# EAGLE design Park-A (EAGLE 7.5.0)
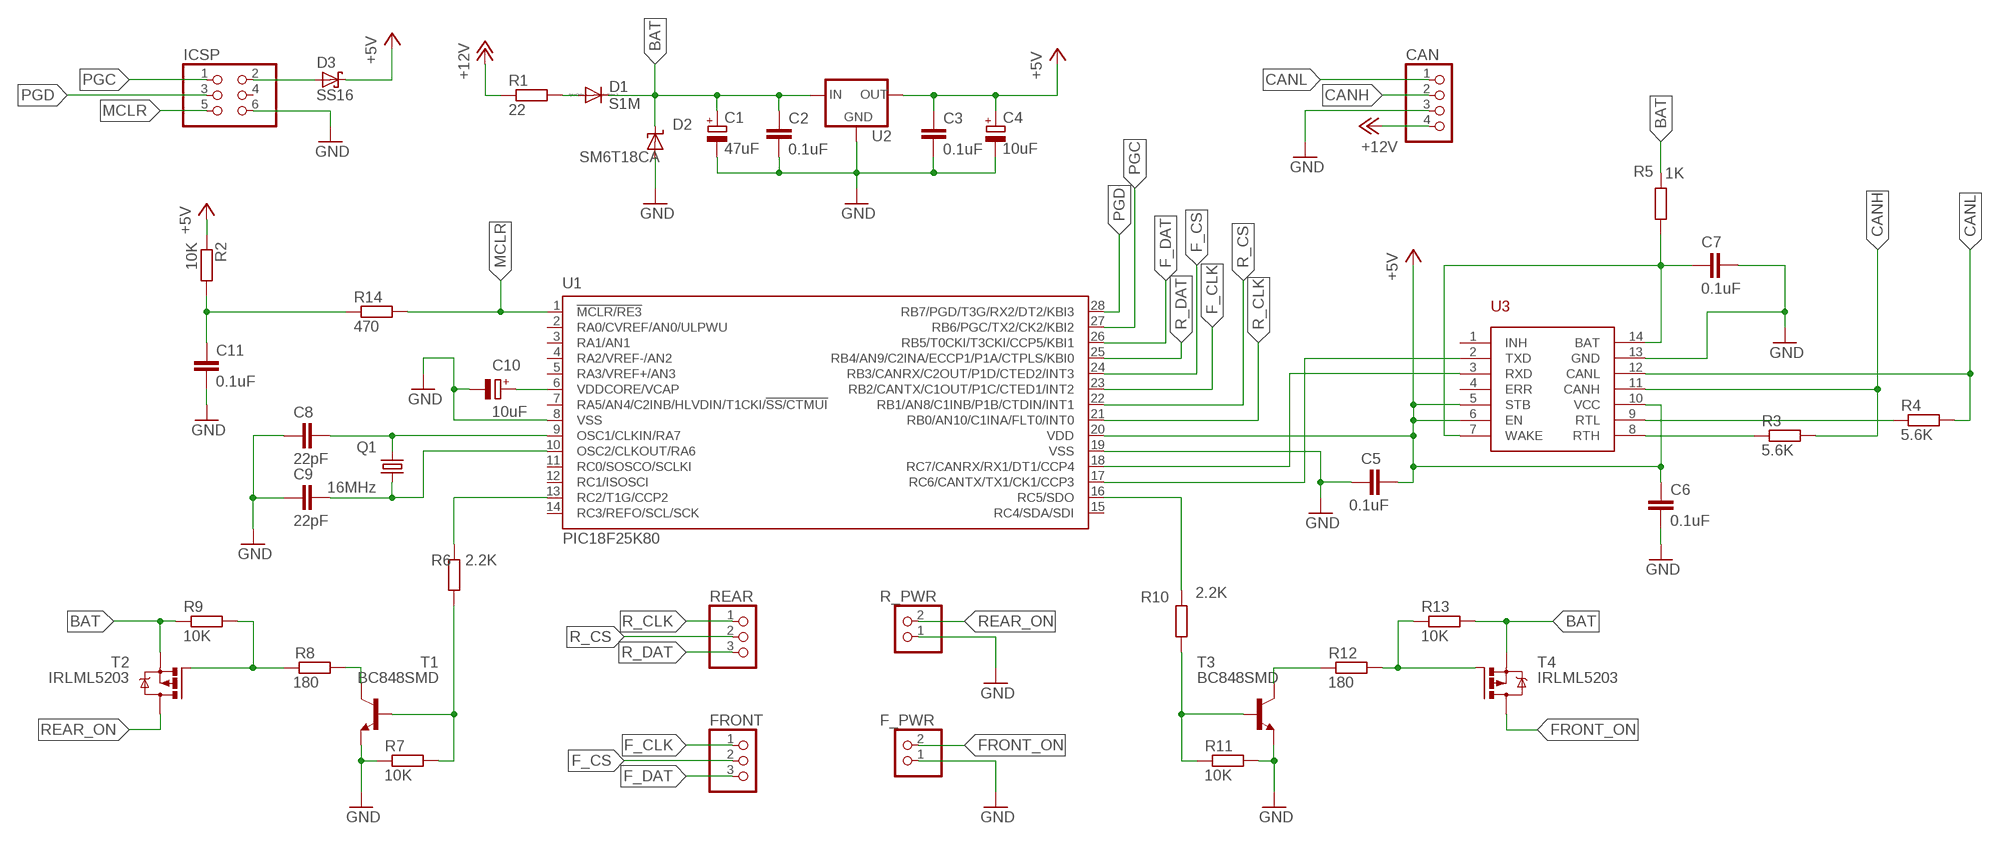
[diagram p0: schematic, sheet 1]

## Parts
C1  47uF  CPOL-EU140CLH-0810  [140CLH-0810]
C2  0.1uF  C-EUC0805  [C0805]
C3  0.1uF  C-EUC0805  [C0805]
C4  10uF  CPOL-EU153CLV-0605  [153CLV-0605]
C5  0.1uF  C-EUC0805  [C0805]
C6  0.1uF  C-EUC0805  [C0805]
C7  0.1uF  C-EUC0805  [C0805]
C8  22pF  C-EUC0805  [C0805]
C9  22pF  C-EUC0805  [C0805]
C10  10uF  CPOL-EUSMCA  [SMC_A]
C11  0.1uF  C-EUC0805  [C0805]
CAN  PINHD-1X4  [1X04]
D1  S1M  [SMA]
D2  SM6T18CA  SUPPRESSOR-SMBJ  [SMBJ]
D3  SS16  [DO214AC]
F_PWR  PINHD-1X2  [1X02]
FRONT  PINHD-1X3  [1X03]
ICSP  PINHD-2X3  [2X03]
Q1  16MHz  CRYSTALHC49S  [HC49/S]
R1  22  R-EU_M1206  [M1206]
R2  10K  R-EU_R0805  [R0805]
R3  5.6K  R-EU_R0805  [R0805]
R4  5.6K  R-EU_R0805  [R0805]
R5  1K  R-EU_R0805  [R0805]
R6  2.2K  R-EU_R0805  [R0805]
R7  10K  R-EU_R0805  [R0805]
R8  180  R-EU_R0805  [R0805]
R9  10K  R-EU_R0805  [R0805]
R10  2.2K  R-EU_R0805  [R0805]
R11  10K  R-EU_R0805  [R0805]
R12  180  R-EU_R0805  [R0805]
R13  10K  R-EU_R0805  [R0805]
R14  470  R-EU_R0805  [R0805]
R_PWR  PINHD-1X2  [1X02]
REAR  PINHD-1X3  [1X03]
T1  BC848SMD  [SOT23]
T2  IRLML5203  [SOT23]
T3  BC848SMD  [SOT23]
T4  IRLML5203  [SOT23]
U1  PIC18F25K80  [SO28W]
U2  78M05  [DPACK]
U3  TJA1055T  [SO-14W]

## Nets
+5V: C3.1 C4.+ C5.1 C6.1 D3.C R2.1 U1.20(VDD) U2.3(OUT) U3.5(STB) U3.6(EN) U3.10(VCC)
+12V: CAN.4 R1.1
BAT: C1.+ C2.1 D1.C D2.C R5.2 R9.1 R13.2 T2.2(S) T4.2(S) U2.1(IN)
CANH: CAN.2 R3.2 U3.11(CANH)
CANL: CAN.1 R4.2 U3.12(CANL)
F_CLK: FRONT.1 U1.23(RB2/CANTX/C1OUT/P1C/CTED1/INT2)
F_CS: FRONT.2 U1.24(RB3/CANRX/C2OUT/P1D/CTED2/INT3)
F_DAT: FRONT.3 U1.26(RB5/T0CKI/T3CKI/CCP5/KBI1)
FRONT_ON: F_PWR.2 T4.3(D)
GND: C1.- C2.2 C3.2 C4.- C5.2 C6.2 C7.2 C8.1 C9.1 C10.- C11.2 CAN.3 D2.A F_PWR.1 ICSP.6 R7.1 R11.2 R_PWR.1 T1.2(E) T3.2(E) U1.8(VSS) U1.19(VSS) U2.4(GND) U3.13(GND)
MCLR: ICSP.5 R14.2 U1.1(!MCLR/RE3)
N$1: D1.A R1.2
N$2: U1.17(RC6/CANTX/TX1/CK1/CCP3) U3.2(TXD)
N$3: U1.18(RC7/CANRX/RX1/DT1/CCP4) U3.3(RXD)
N$4: C11.1 R2.2 R14.1
N$5: C8.2 Q1.1 U1.9(OSC1/CLKIN/RA7)
N$6: C7.1 R5.1 U3.7(WAKE) U3.14(BAT)
N$7: C9.2 Q1.2 U1.10(OSC2/CLKOUT/RA6)
N$8: C10.+ U1.6(VDDCORE/VCAP)
N$9: R6.2 U1.13(RC2/T1G/CCP2)
N$10: R6.1 R7.2 T1.1(B)
N$11: R3.1 U3.8(RTH)
N$12: R4.1 U3.9(RTL)
N$13: R8.1 T1.3(C)
N$14: R8.2 R9.2 T2.1(G)
N$15: R10.2 U1.16(RC5/SDO)
N$16: R10.1 R11.1 T3.1(B)
N$17: R12.1 T3.3(C)
N$18: R12.2 R13.1 T4.1(G)
N$20: D3.A ICSP.2
PGC: ICSP.1 U1.27(RB6/PGC/TX2/CK2/KBI2)
PGD: ICSP.3 U1.28(RB7/PGD/T3G/RX2/DT2/KBI3)
R_CLK: REAR.1 U1.21(RB0/AN10/C1INA/FLT0/INT0)
R_CS: REAR.2 U1.22(RB1/AN8/C1INB/P1B/CTDIN/INT1)
R_DAT: REAR.3 U1.25(RB4/AN9/C2INA/ECCP1/P1A/CTPLS/KBI0)
REAR_ON: R_PWR.2 T2.3(D)
Unconnected: ICSP.4 U1.2(RA0/CVREF/AN0/ULPWU) U1.3(RA1/AN1) U1.4(RA2/VREF-/AN2) U1.5(RA3/VREF+/AN3) U1.7(RA5/AN4/C2INB/HLVDIN/T1CKI/!SS/CTMUI) U1.11(RC0/SOSCO/SCLKI) U1.12(RC1/ISOSCI) U1.14(RC3/REFO/SCL/SCK) U1.15(RC4/SDA/SDI) U3.1(INH) U3.4(ERR)

## Library data of the parts
C1 C4 C10 = rcl:CPOL-EU: POLARIZED CAPACITOR, European symbol
C2 C3 C5-C9 C11 = rcl:C-EU: CAPACITOR, European symbol
CAN = Park-A:PINHD-1X4: PIN HEADER
D1 = diode:S1M
D2 = diode:SUPPRESSOR-: Suppressor diode
D3 = Park-A:SS16
F_PWR R_PWR = Park-A:PINHD-1X2: PIN HEADER
FRONT REAR = Park-A:PINHD-1X3: PIN HEADER
ICSP = Park-A:PINHD-2X3: PIN HEADER
Q1 = Park-A:CRYSTAL: CRYSTAL; OC_FARNELL: 1667008; OC_NEWARK: unknown
R1-R14 = rcl:R-EU_: RESISTOR, European symbol
T1 T3 = Park-A:BC848*: NPN Transistor
T2 T4 = Park-A:IRLML5203: HEXFET P-Channel Power MOSFET
U1 = Park-A:PIC18F25K80
U2 = Park-A:78M05
U3 = Park-A:TJA1055T

## Board
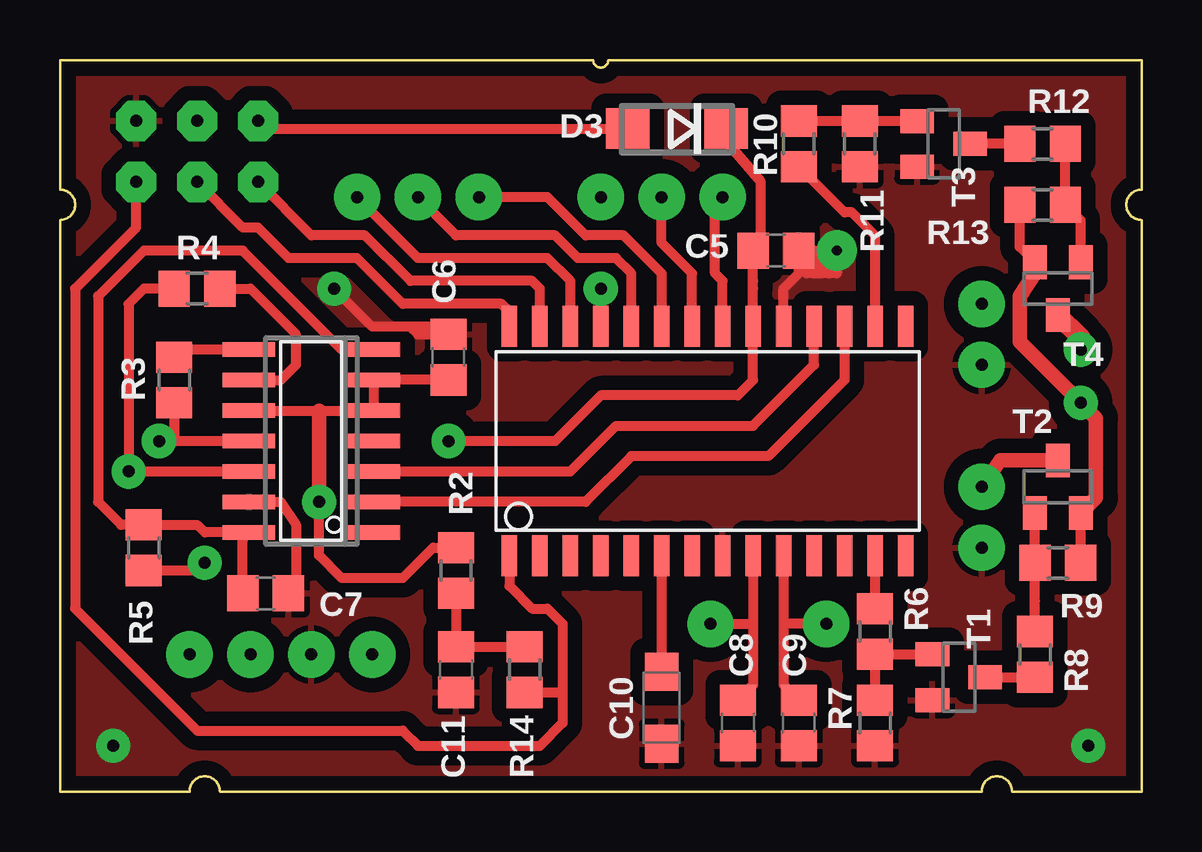
[diagram p1: board, top side]
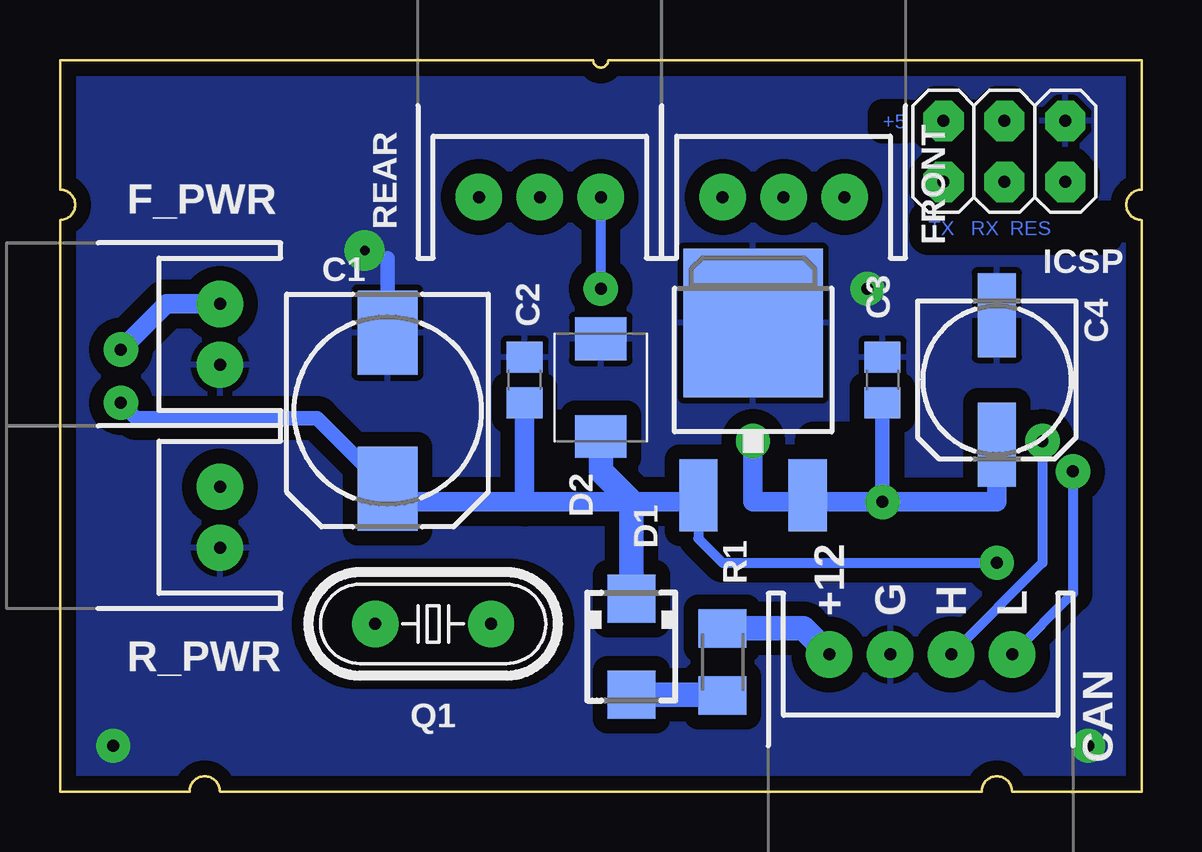
[diagram p2: board, bottom side, seen from below]

Size 45.09 x 30.48 mm. Coordinates in mm from the lower left corner, seen from the top.
Outline: 22.86,30.48 arc-180 22.23,30.48 0,30.48 0,25.08 arc-180 0,23.81 0,0 5.4,0 arc-180 6.67,0 38.42,0 arc-180 39.69,0 45.09,0 45.09,23.81 arc-180 45.09,25.08 45.09,30.48 22.86,30.48
Copper layers (1*16): Top 0.035mm / dielectric 1.5mm / Bottom 0.035mm
Design rules "ITEADstudio_DRC *": minimum track width 6mil, minimum drill 12mil, track to track 6mil, track to pad 6mil, pad to pad 6mil, via to via 6mil, smd to smd 0mil, copper to edge 10mil, drill to drill 10mil, minimum pad ring 10mil, minimum via ring 6mil, stop-mask expansion 2mil, vias tented up to drill 100mil, thermal gap 10mil
tRestrict: 8 lines
bRestrict: 9 lines

### Footprints (pad centres in the part's own frame; a part is rotated, then mirrored left to right if it is on the bottom)
140CLH-0810 = smd 3.5 x 2.5: + 3.25,0; - -3.25,0
C0805 = smd 1.3 x 1.5: 1 -0.95,0; 2 0.95,0
153CLV-0605 = smd 3.5 x 1.6: + 2.7,0; - -2.7,0
SMC_A = smd 1.6 x 1.4: + -1.5,0; - 1.5,0
1X04 = drill 0.5 pad 1.93: 1 -3.81,0; 2 -1.27,0; 3 1.27,0; 4 3.81,0
SMA = smd 2 x 2: A 2,0; C -2,0
SMBJ = smd 1.78 x 2.16: A 2.04,0; C -2.03,0
DO214AC = smd 1.8 x 1.7: A 2.05,0; C -2.05,0
1X02 = drill 0.5 pad 1.93: 1 -1.27,0; 2 1.27,0
1X03 = drill 0.5 pad 1.93: 1 -2.54,0; 2 0,0; 3 2.54,0
2X03 = drill 0.5 pad 1.676 octagon: 1 -2.54,-1.27; 2 -2.54,1.27; 3 0,-1.27; 4 0,1.27; 5 2.54,-1.27; 6 2.54,1.27
HC49/S = drill 0.5 pad 1.93: 1 -2.413,0; 2 2.413,0
M1206 = smd 1.6 x 2: 1 -1.4,0; 2 1.4,0
R0805 = smd 1.3 x 1.5: 1 -0.95,0; 2 0.95,0
SOT23 = smd 1 x 1.4: 1 -0.95,-1.1; 2 0.95,-1.1; 3 0,1.1
SO28W = smd 0.65 x 1.7: 1 -7.62,-4.78; 2 -6.35,-4.78; 3 -5.08,-4.78; 4 -3.81,-4.78; 5 -2.54,-4.78; 6 -1.27,-4.78; 7 0,-4.78; 8 1.27,-4.78; 9 2.54,-4.78; 10 3.81,-4.78; 11 5.08,-4.78; 12 6.35,-4.78; 13 7.62,-4.78; 14 8.89,-4.78; 15 8.89,4.78; 16 7.62,4.78; 17 6.35,4.78; 18 5.08,4.78; 19 3.81,4.78; 20 2.54,4.78; 21 1.27,4.78; 22 0,4.78; 23 -1.27,4.78; 24 -2.54,4.78; 25 -3.81,4.78; 26 -5.08,4.78; 27 -6.35,4.78; 28 -7.62,4.78
DPACK = smd 1.6 x 3: 1 -2.28,-4.8; 3 2.28,-4.8 | smd 5.8 x 6.2: 4 0,2.38
SO-14W = smd 0.6 x 2.2: 1 -3.81,-2.6; 2 -2.54,-2.6; 3 -1.27,-2.6; 4 0,-2.6; 5 1.27,-2.6; 6 2.54,-2.6; 7 3.81,-2.6; 8 3.81,2.6; 9 2.54,2.6; 10 1.27,2.6; 11 0,2.6; 12 -1.27,2.6; 13 -2.54,2.6; 14 -3.81,2.6

### Placement (x,y rotation side)
C1  31.43,15.88 270 bottom
C2  25.72,17.14 90 bottom
C3  10.8,17.14 90 bottom
C4  6.03,17.14 270 bottom
C5  29.84,22.54 0 top
C6  16.19,18.1 90 top
C7  8.57,8.25 0 top
C8  28.26,2.86 90 top
C9  30.8,2.86 90 top
C10  25.08,3.49 270 top
C11  16.51,5.08 270 top
CAN  9.21,5.71 180 bottom
D1  21.27,6.03 270 bottom
D2  22.54,16.83 90 bottom
D3  25.72,27.62 180 top
F_PWR  38.42,19.05 90 bottom
FRONT  14.92,24.76 0 bottom
ICSP  5.71,26.67 0 bottom
Q1  29.53,6.98 180 bottom
R1  17.46,5.4 270 bottom
R2  16.51,9.21 270 top
R3  4.76,17.14 270 top
R4  5.71,20.95 180 top
R5  3.49,10.16 270 top
R6  33.97,6.67 90 top
R7  33.97,2.86 90 top
R8  40.64,5.71 90 top
R9  41.59,9.52 180 top
R10  30.8,26.99 270 top
R11  33.34,26.99 270 top
R12  40.96,26.99 0 top
R13  40.96,24.45 180 top
R14  19.37,5.08 270 top
R_PWR  38.42,11.43 90 bottom
REAR  25.08,24.76 0 bottom
T1  37.47,4.76 270 top
T2  41.59,12.7 0 top
T3  36.83,26.99 270 top
T4  41.59,20.95 180 top
U1  26.35,14.6 0 top
U2  16.19,17.14 0 bottom
U3  10.48,14.6 90 top

### Tracks (layer width: path | path; a pad name or v marks a point on that pad's centre or on a via)
+5V  (via drill 0.5 pad 1.42)
  Top 0.406: v10.8,12.06 10.8,9.84 11.75,8.89 14.29,8.89 15.55,10.16 R2.1 | U3.10 10.8,15.88 U3.5 U3.6 C6.1 | v16.19,14.6 20.64,14.6 22.54,16.51 28.26,16.51 28.89,17.14 U1.20 28.89,20.95 28.9,21.27 C5.1 29.21,23.17 29.21,25.4 27.45,27.48 D3.C
  Top 0.61: 10.8,15.88 v10.8,12.06
  Bottom 0.61: C3.1 v10.8,12.06
  Bottom 0.813: C4.+ 6.03,12.06 v10.8,12.06 13.65,12.06 13.91,12.32 U2.3 14.19,12.06 16.19,12.06 v16.19,14.6
+12V
  Bottom 1.016: CAN.4 14.1,6.8 R1.1
BAT  (via drill 0.5 pad 1.42)
  Top 0.406: R5.2 5.72,9.21 v6.03,9.52 | R9.1 T2.2 | T4.2 40.01,22.69 R13.2
  Top 0.61: T4.2 40.64,21.59 40.01,20.64 40.01,18.73 v42.55,16.19 43.18,15.56 43.18,12.24 T2.2
  Bottom 0.406: U2.1 18.47,10.53 17.46,9.52 v6.03,9.52
  Bottom 0.61: C1.+ 34.37,15.56 41.91,15.56 v42.55,16.19
  Bottom 0.813: U2.1 18.83,12.06 21.27,12.06 25.72,12.06 | 25.72,12.06 31.43,12.06 C1.+ | C2.1 25.72,12.06
  Bottom 1.016: D1.C 21.27,12.06 22.54,13.34 D2.C
CANH  (via drill 0.5 pad 1.42)
  Top 0.406: U3.11 4.76,14.6 | 4.76,14.6 v4.13,14.6 | R3.2 4.76,14.6
  Bottom 0.406: v4.13,14.6 4.13,9.52 CAN.2
CANL  (via drill 0.5 pad 1.42)
  Top 0.406: R4.2 3.49,20.95 2.86,20.32 v2.86,13.34 U3.12
  Bottom 0.406: v2.86,13.34 2.86,8.25 CAN.1
F_CLK
  Top 0.406: U1.23 25.08,21.59 23.5,23.18 21.91,23.18 20.32,24.76 FRONT.1
F_CS
  Top 0.406: U1.24 23.81,21.59 23.18,22.22 21.59,22.22 20.64,23.18 16.51,23.18 FRONT.2
F_DAT
  Top 0.406: U1.26 21.27,21.27 20.32,22.22 14.92,22.22 FRONT.3
FRONT_ON  (via drill 0.5 pad 1.42)
  Top 0.813: v42.55,18.41 42.55,18.9 T4.3
  Bottom 0.813: v42.55,18.41 40.64,20.32 F_PWR.2
GND  (via drill 0.4 pad 1.68, 0.5 pad 1.42)
  Top 0.406: U3.13 9.21,12.06 9.84,11.11 9.84,8.25 C7.2 | U1.19 30.16,20.95 30.8,21.59 C5.2 | 14.6,19.37 14.92,19.05 C6.2 16.19,19.37 13.02,19.37 v11.43,20.95 | C5.2 31.12,22.54 | 31.43,22.54 31.75,22.54 | 32.07,22.54 v32.38,22.54 32.38,21.59 32.07,21.59 | 32.07,21.59 31.75,21.59 | 31.43,21.59 31.12,21.59 31.12,22.54 | 31.12,22.54 31.43,22.54 | 31.43,22.54 31.43,21.59 | 31.43,21.59 31.75,21.59 | 31.75,21.59 31.75,22.54 | 31.75,22.54 32.07,22.54 | 32.07,22.54 32.07,21.59
  Bottom 0.61: C1.- 31.43,22.22
  other vias: 2.22,1.9 42.86,1.9
  pour Top (isolate 0.61): -5.4,34.93 50.48,34.93 50.48,-4.45 -5.4,-4.45
  pour Bottom (isolate 0.61): -1.59,33.65 47.94,33.65 47.94,-3.18 -1.59,-3.18
MCLR
  Top 0.406: U1.1 18.73,8.57 19.69,7.62 20.32,7.62 20.95,6.98 20.95,4.13 | 20.95,4.13 20.95,2.86 20,1.9 14.92,1.9 14.29,2.54 5.71,2.54 0.64,7.62 0.64,20.95 3.17,23.49 ICSP.5 | R14.2 20.64,4.13 20.95,4.13
N$1
  Bottom 1.016: R1.2 17.5,4.03 D1.A
N$2
  Top 0.406: U1.17 32.7,17.14 29.53,13.97 23.81,13.97 21.91,12.06 U3.2
N$3
  Top 0.406: U3.3 21.27,13.34 23.18,15.24 28.89,15.24 31.43,17.78 U1.18
N$4
  Top 0.406: R2.2 C11.1 R14.1
N$5
  Top 0.406: U1.9 28.89,6.98 | 28.89,6.98 28.89,4.44 C8.2 | Q1.1 28.89,6.98
N$6
  Top 0.406: U3.7 11.75,18.41 7.62,22.54 3.49,22.54 1.59,20.64 1.59,12.06 2.54,11.11 R5.1 5.72,11.11 6.03,10.79 7.3,10.79 | U3.14 7.3,10.79 | C7.1 7.62,10.47 arc90 7.3,10.79
N$7
  Top 0.406: U1.10 30.16,6.98 | 30.16,6.98 30.16,4.44 C9.2 | Q1.2 30.16,6.98
N$8
  Top 0.406: U1.6 C10.+
N$9
  Top 0.406: U1.13 R6.2
N$10
  Top 0.406: R7.2 R6.1 T1.1
N$11
  Top 0.406: U3.8 4.76,18.41 R3.1
N$12
  Top 0.406: U3.9 9.21,17.14 9.84,17.78 9.84,19.05 7.94,20.95 R4.1
N$13
  Top 0.406: T1.3 R8.1
N$14
  Top 0.406: R8.2 40.64,7.94 R9.2 T2.1
N$15
  Top 0.406: U1.16 33.97,23.18 33.02,24.13 32.7,24.13 R10.2
N$16
  Top 0.406: T3.1 R11.1 R10.1
N$17
  Top 0.406: R12.1 T3.3
N$18
  Top 0.406: R12.2 R13.1 42.54,23.81 T4.1
N$20
  Top 0.406: ICSP.2 8.89,27.62 D3.A
PGC
  Top 0.406: U1.27 20,20.95 19.69,21.27 14.61,21.27 12.7,23.18 10.48,23.18 ICSP.1
PGD
  Top 0.406: U1.28 18.73,20 18.41,20.32 14.29,20.32 12.38,22.22 9.53,22.22 8.26,23.49 7.62,23.49 ICSP.3
R_CLK
  Top 0.406: U1.21 27.62,21.27 27.3,21.59 27.3,24.45 REAR.1
R_CS
  Top 0.406: U1.22 26.35,21.59 25.08,22.86 REAR.2
R_DAT  (via drill 0.5 pad 1.42)
  Top 0.406: U1.25 v22.54,20.95
  Bottom 0.406: v22.54,20.95 REAR.3
REAR_ON
  Top 0.61: R_PWR.2 39.2,13.8 T2.3

### Text on the board
Bottom: +5 | TX RX RES
bNames: L | H | G | +12